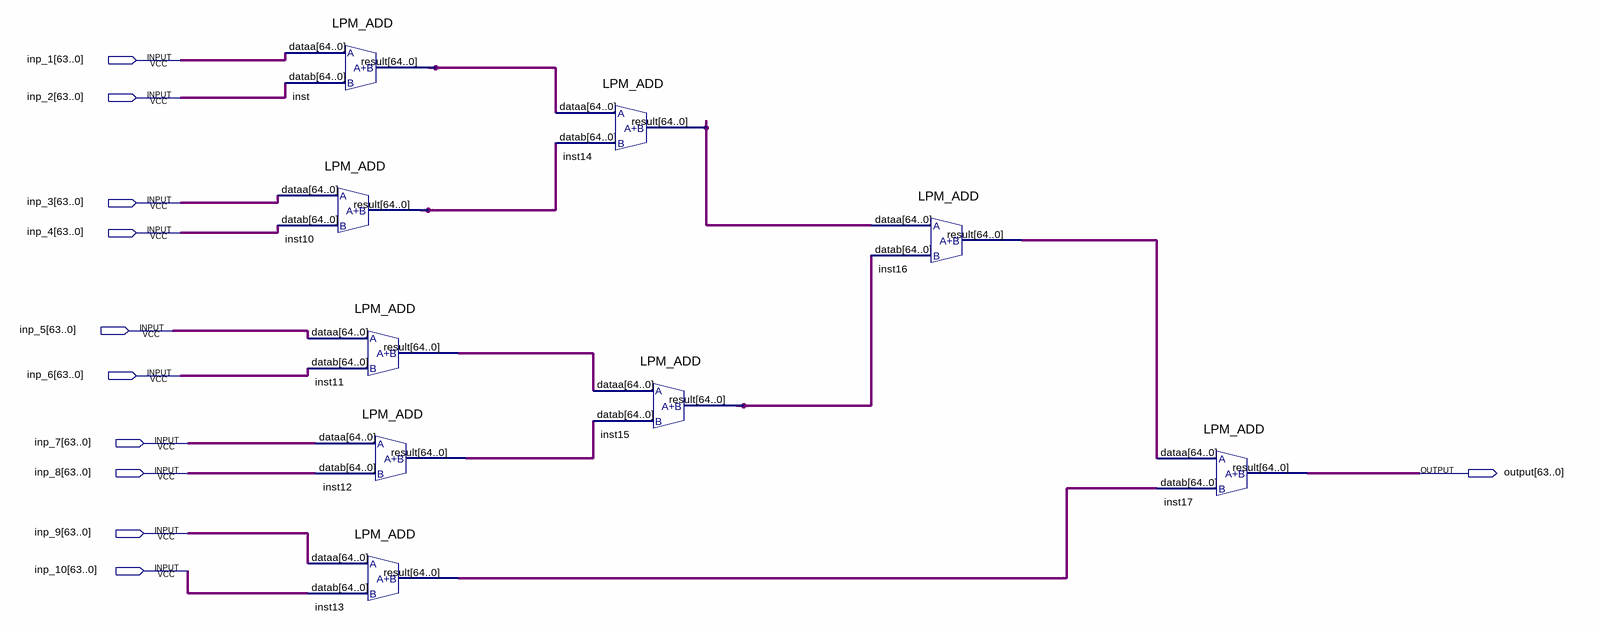
[diagram p0: schematic sheet]
// Quartus schematic adder_10_10.bdf as structural Verilog: 9 symbols, 11 pins
module adder_10_10 (
  input  [63:0] inp_1,
  input  [63:0] inp_2,
  input  [63:0] inp_3,
  input  [63:0] inp_4,
  input  [63:0] inp_5,
  input  [63:0] inp_6,
  input  [63:0] inp_7,
  input  [63:0] inp_8,
  input  [63:0] inp_9,
  input  [63:0] inp_10,
  output [63:0] \output 
);

  wire [64:0] inst10_result, inst11_result, inst12_result, inst13_result, inst14_result, inst15_result,
       inst16_result, inst_result;

  LPM_ADD inst (.dataa(inp_1), .datab(inp_2), .result(inst_result));
  LPM_ADD inst10 (.dataa(inp_3), .datab(inp_4), .result(inst10_result));
  LPM_ADD inst11 (.dataa(inp_5), .datab(inp_6), .result(inst11_result));
  LPM_ADD inst12 (.dataa(inp_7), .datab(inp_8), .result(inst12_result));
  LPM_ADD inst13 (.dataa(inp_9), .datab(inp_10), .result(inst13_result));
  LPM_ADD inst14 (.dataa(inst_result), .datab(inst10_result), .result(inst14_result));
  LPM_ADD inst15 (.dataa(inst11_result), .datab(inst12_result), .result(inst15_result));
  LPM_ADD inst16 (.dataa(inst14_result), .datab(inst15_result), .result(inst16_result));
  LPM_ADD inst17 (.dataa(inst16_result), .datab(inst13_result), .result(\output ));
endmodule
